# EAGLE schematic AusgangsVerstärker (EAGLE 5.11)
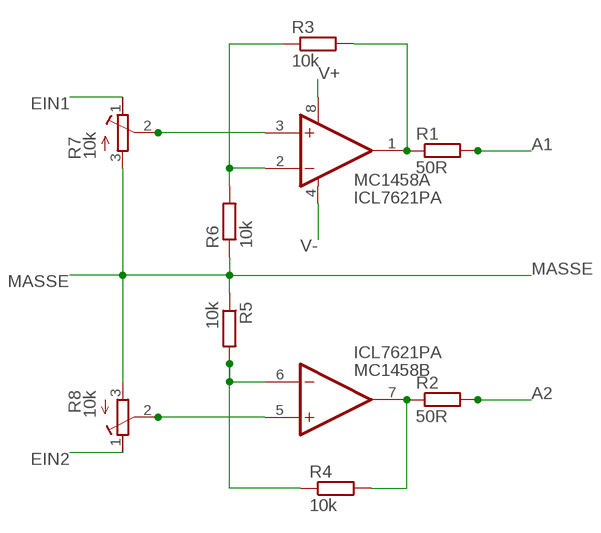
[diagram p0: schematic, sheet 1]

## Parts
MC1458  ICL7621PA  [DIL08]
R1  50R  R-EU_0207/10  [0207/10]
R2  50R  R-EU_0207/10  [0207/10]
R3  10k  R-EU_0207/10  [0207/10]
R4  10k  R-EU_0207/10  [0207/10]
R5  10k  R-EU_0207/10  [0207/10]
R6  10k  R-EU_0207/10  [0207/10]
R7  10k  R-TRIMMT93YA  [RTRIMT93YA]
R8  10k  R-TRIMMT93YA  [RTRIMT93YA]

## Nets
A1: R1.2
A2: R2.2
E1: MC1458.3(A:+IN) R7.2(S)
E2: MC1458.5(B:+IN) R8.2(S)
EIN1: R7.1(A)
EIN2: R8.1(A)
MASSE: R5.1 R6.1 R7.3(E) R8.3(E)
N$1: MC1458.1(A:OUT) R1.1 R3.2
N$2: MC1458.7(B:OUT) R2.1 R4.2
N$3: MC1458.2(A:-IN) R3.1 R6.2
N$4: MC1458.6(B:-IN) R4.1 R5.2
V+: MC1458.8(A:V+)
V-: MC1458.4(A:V-)

## Library data of the parts
MC1458 = maxim:ICL7621: Dual Operational Amplifiers Source: http://datasheets.maxim-ic.com/en/ds/ICL7612-ICL764X.pdf; OC_FARNELL: unknown; OC_NEWARK: unknown
R1-R6 = resistor:R-EU_: RESISTOR, European symbol
R7 R8 = resistor:R-TRIMM: Trimm resistor